# EAGLE design Transmitter (EAGLE 4.16)
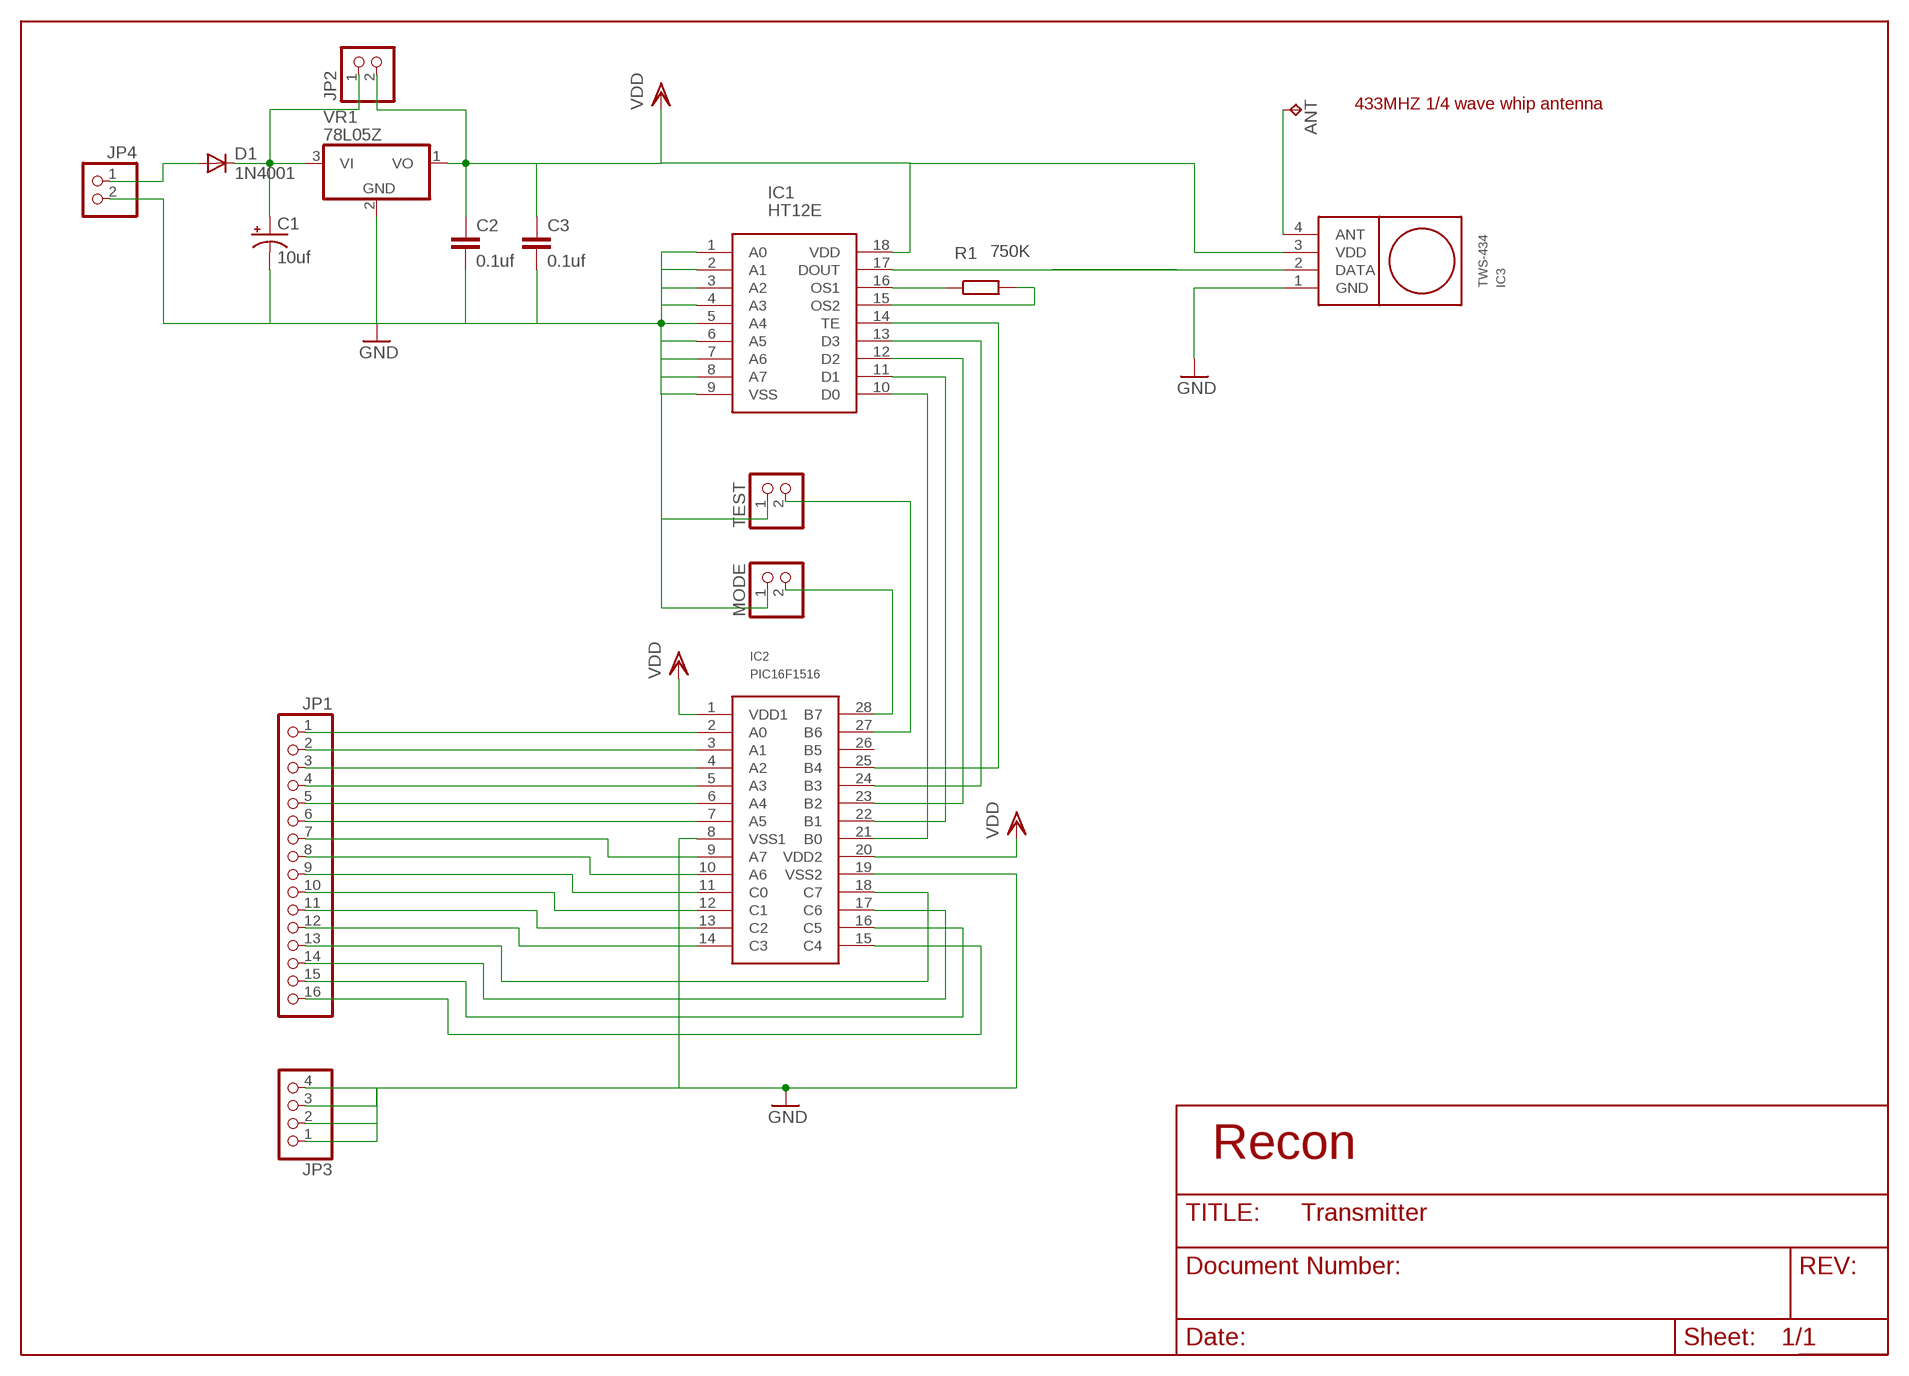
[diagram p0: schematic, sheet 1]

## Parts
ANT  433 qtr wave whip  TPPAD1-13Y  [P1-13Y]
C1  10uf  CPOL-USE2.5-5  [E2,5-5]
C2  0.1uf  C-EU050-024X044  [C050-024X044]
C3  0.1uf  C-EU050-024X044  [C050-024X044]
D1  1N4001  [DO41-10]
IC1  HT12E  [DIL18]
IC2  PIC16F1516  [DIL28-3]
IC3  TWS-434  [TWS-434]
JP1  PINHD-1X16  [1X16]
JP2  PINHD-1X2  [1X02]
JP3  PINHD-1X4  [1X04]
JP4  PINHD-1X2  [1X02]
MODE  PINHD-1X2  [1X02]
R1  750K  R-EU_0204/2V  [0204V]
TEST  PINHD-1X2  [1X02]
VR1  78L05Z  [TO92]

## Nets
D0: IC1.10(D0) IC2.21(B0)
D1: IC1.11(D1) IC2.22(B1)
D2: IC1.12(D2) IC2.23(B2)
D3: IC1.13(D3) IC2.24(B3)
D_OUT: IC1.17(DOUT) IC3.2(DATA)
GND: C1.- C2.2 C3.2 IC1.1(A0) IC1.2(A1) IC1.3(A2) IC1.4(A3) IC1.5(A4) IC1.6(A5) IC1.7(A6) IC1.8(A7) IC1.9(VSS) IC2.8(VSS1) IC2.19(VSS2) IC3.1(GND) JP3.1 JP3.2 JP3.3 JP3.4 JP4.2 MODE.1 TEST.1 VR1.2(GND)
MODE: IC2.28(B7) MODE.2
N$1: D1.A JP4.1
N$2: C1.+ D1.C JP2.1 VR1.3(VI)
N$3: IC1.16(OS1) R1.1
N$4: IC1.15(OS2) R1.2
N$6: ANT.1(TP) IC3.4(ANT)
N$8: IC2.2(A0) JP1.1
N$9: IC2.3(A1) JP1.2
N$10: IC2.4(A2) JP1.3
N$11: IC2.5(A3) JP1.4
N$12: IC2.6(A4) JP1.5
N$13: IC2.7(A5) JP1.6
N$14: IC2.9(A7) JP1.7
N$15: IC2.10(A6) JP1.8
N$16: IC2.11(C0) JP1.9
N$17: IC2.12(C1) JP1.10
N$18: IC2.13(C2) JP1.11
N$19: IC2.14(C3) JP1.12
N$20: IC2.18(C7) JP1.13
N$21: IC2.17(C6) JP1.14
N$22: IC2.16(C5) JP1.15
N$23: IC2.15(C4) JP1.16
TE: IC1.14(TE) IC2.25(B4)
TEST: IC2.27(B6) TEST.2
VDD: C2.1 C3.1 IC1.18(VDD) IC2.1(VDD1) IC2.20(VDD2) IC3.3(VDD) JP2.2 VR1.1(VO)
Unconnected: IC2.26(B5)

## Notes on the sheet
- 433MHZ 1/4 wave whip antenna

## Library data of the parts
ANT = Stofer:TP
C1 = rcl:CPOL-US: POLARIZED CAPACITOR, American symbol
C2 C3 = rcl:C-EU: CAPACITOR, European symbol
D1 = Recon:1N4001: DIODE general purpose rectifier, 1 A
IC1 = Recon:HT12E
IC2 = Recon:PIC16F1516
IC3 = Recon:TWS-434
JP1 = Headers:PINHD-1X16: PIN HEADER
JP2 JP4 MODE TEST = Headers:PINHD-1X2: PIN HEADER
JP3 = Headers:PINHD-1X4: PIN HEADER
R1 = rcl:R-EU_: RESISTOR, European symbol
VR1 = linear:78*: Positive VOLTAGE REGULATOR Source: http://cache.national.com/ds/LM/LM78L05.pdf http://www.fairchildsemi.com/ds/LM/LM7805.pdf

## Board
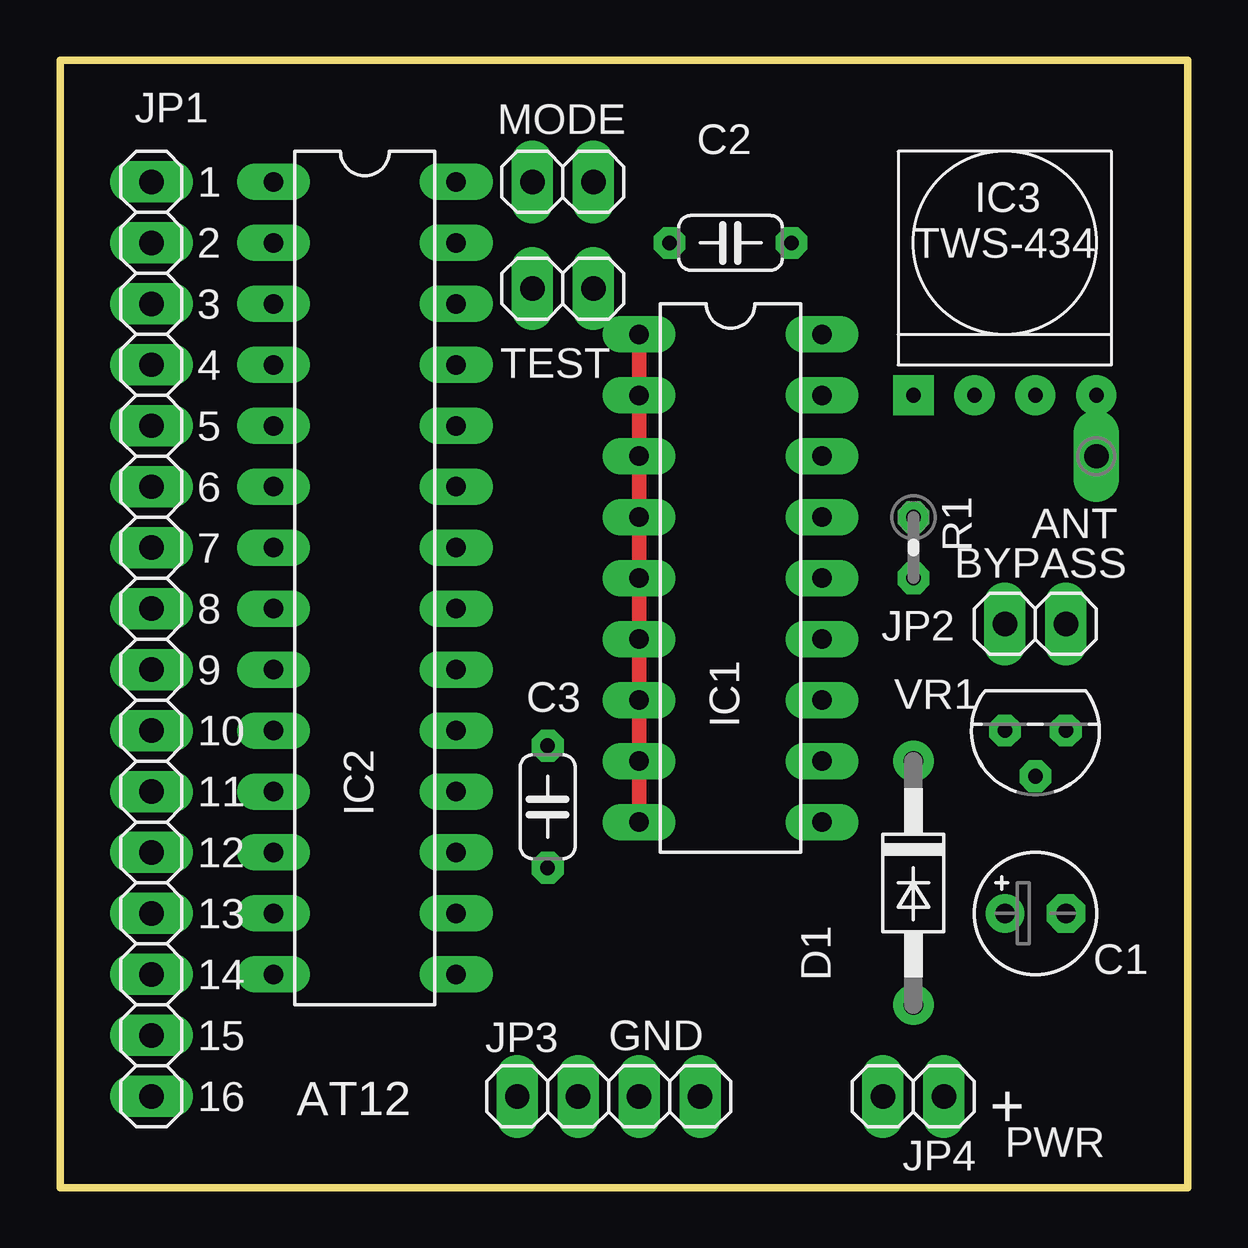
[diagram p1: board, top side]
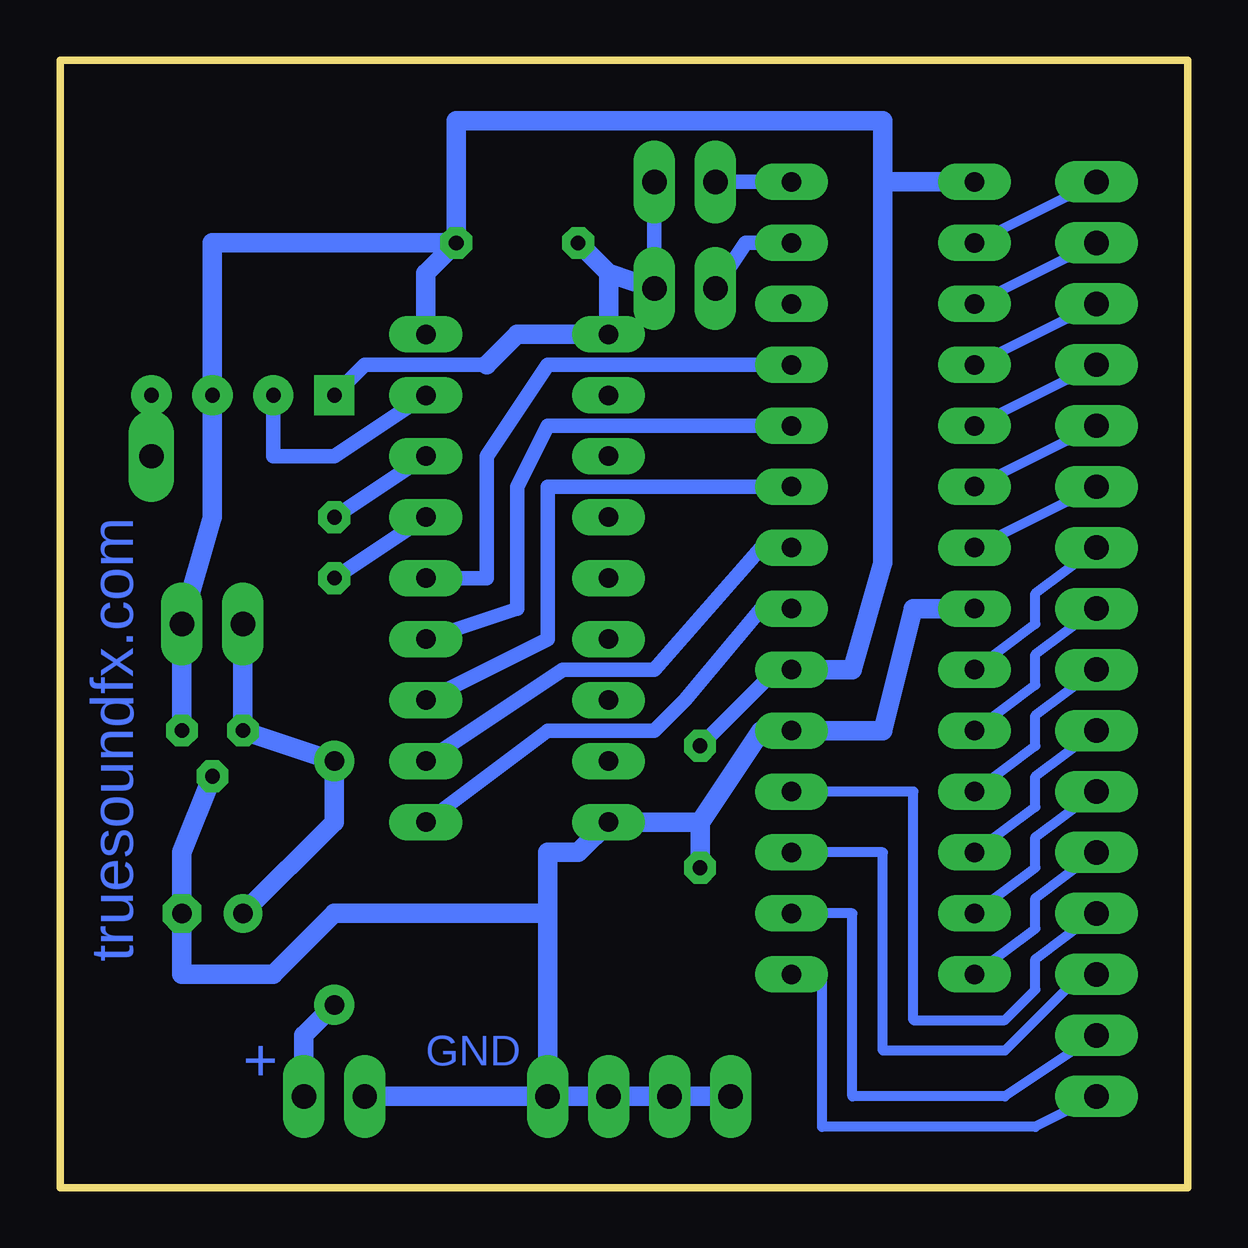
[diagram p2: board, bottom side, seen from below]

Size 46.99 x 46.99 mm. Coordinates in mm from the lower left corner, seen from the top.
Outline: 0,0 46.99,0 46.99,46.99 0,46.99 0,0
Copper layers (1*2+15*16): Top 0.035mm / dielectric 0.2mm / Route2 0.035mm / dielectric 0.15mm / Route15 0.035mm / dielectric 0.2mm / Bottom 0.035mm
Design rules "default": minimum track width 10mil, minimum drill 24mil, track to track 8mil, track to pad 8mil, pad to pad 8mil, via to via 8mil, smd to smd 8mil, copper to edge 40mil, drill to drill 8mil, minimum pad ring 14mil, minimum via ring 8mil, stop-mask expansion 4mil, vias tented up to drill 0mil, thermal gap 10mil

### Footprints (pad centres in the part's own frame; a part is rotated, then mirrored left to right if it is on the bottom)
P1-13Y = drill 1.016 pad 1.905 long: 1 0,0
E2,5-5 = drill 0.813 pad 1.6 round: + -1.27,0 | drill 0.813 pad 1.6 octagon: - 1.27,0
C050-024X044 = drill 0.61 octagon: 1 -2.54,0; 2 2.54,0
DO41-10 = drill 0.813 pad 1.676 round: A 5.08,0; C -5.08,0
DIL18 = drill 0.813 long: 1 -10.16,-3.81; 2 -7.62,-3.81; 3 -5.08,-3.81; 4 -2.54,-3.81; 5 0,-3.81; 6 2.54,-3.81; 7 5.08,-3.81; 8 7.62,-3.81; 9 10.16,-3.81; 10 10.16,3.81; 11 7.62,3.81; 12 5.08,3.81; 13 2.54,3.81; 14 0,3.81; 15 -2.54,3.81; 16 -5.08,3.81; 17 -7.62,3.81; 18 -10.16,3.81
DIL28-3 = drill 0.813 long: 1 -16.51,-3.81; 2 -13.97,-3.81; 3 -11.43,-3.81; 4 -8.89,-3.81; 5 -6.35,-3.81; 6 -3.81,-3.81; 7 -1.27,-3.81; 8 1.27,-3.81; 9 3.81,-3.81; 10 6.35,-3.81; 11 8.89,-3.81; 12 11.43,-3.81; 13 13.97,-3.81; 14 16.51,-3.81; 15 16.51,3.81; 16 13.97,3.81; 17 11.43,3.81; 18 8.89,3.81; 19 6.35,3.81; 20 3.81,3.81; 21 1.27,3.81; 22 -1.27,3.81; 23 -3.81,3.81; 24 -6.35,3.81; 25 -8.89,3.81; 26 -11.43,3.81; 27 -13.97,3.81; 28 -16.51,3.81
TWS-434 = drill 0.61 pad 1.676 square: 1 -5.08,-2.54 | drill 0.61 pad 1.676 round: 2 -2.54,-2.54; 3 0,-2.54; 4 2.54,-2.54
1X16 = drill 1.016 long: 1 -19.05,0; 2 -16.51,0; 3 -13.97,0; 4 -11.43,0; 5 -8.89,0; 6 -6.35,0; 7 -3.81,0; 8 -1.27,0; 9 1.27,0; 10 3.81,0; 11 6.35,0; 12 8.89,0; 13 11.43,0; 14 13.97,0; 15 16.51,0; 16 19.05,0
1X02 = drill 1.016 long: 1 -1.27,0; 2 1.27,0
1X04 = drill 1.016 long: 1 -3.81,0; 2 -1.27,0; 3 1.27,0; 4 3.81,0
0204V = drill 0.61 octagon: 1 -1.27,0; 2 1.27,0
TO92 = drill 0.61 octagon: 1 -1.27,0; 2 0,1.905; 3 1.27,0

### Placement (x,y rotation side)
ANT  43.18,30.48 180 top
C1  40.64,11.43 0 top
C2  27.94,39.37 180 top
C3  20.32,15.88 270 top
D1  35.56,12.7 270 top
IC1  27.94,25.4 270 top
IC2  12.7,25.4 270 top
IC3  40.64,35.56 0 top
JP1  3.81,22.86 270 top
JP2  40.64,23.5 0 top
JP3  22.86,3.81 0 top
JP4  35.56,3.81 180 top
MODE  20.95,41.91 180 top
R1  35.56,26.67 270 top
TEST  20.95,37.47 180 top
VR1  40.64,19.05 180 top

### Tracks (layer width: path | path; a pad name or v marks a point on that pad's centre or on a via)
D0
  Bottom 0.61: IC1.10 26.67,19.05 22.22,19.05 20.95,20.32 17.78,24.13 IC2.21
D1
  Bottom 0.61: IC1.11 26.04,21.59 22.22,21.59 17.78,26.67 IC2.22
D2
  Bottom 0.61: IC1.12 26.67,22.86 26.67,29.21 IC2.23
D3
  Bottom 0.61: IC1.13 27.94,24.13 27.94,29.21 26.67,31.75 IC2.24
D_OUT
  Bottom 0.61: IC1.17 35.56,30.48 38.1,30.48 IC3.2
GND
  Top 0.61: IC1.9 IC1.8 IC1.7 IC1.6 IC1.5 IC1.4 IC1.3 IC1.2 IC1.1
  Bottom 0.61: TEST.1 MODE.1 | 29.21,34.29 34.29,34.29 IC3.1
  Bottom 0.813: IC2.8 11.43,24.13 12.7,19.05 IC2.19 17.78,19.05 20.32,15.24 | 24.13,38.1 IC1.1 27.94,35.56 29.21,34.29 | 20.32,15.24 IC1.9 25.4,13.97 26.67,13.97 26.67,11.43 | 20.32,15.24 C3.2 | 24.13,38.1 C2.2 | 24.13,38.1 TEST.1 | JP3.1 JP3.2 JP3.3 JP3.4 | JP3.4 JP4.2 | JP3.4 26.67,11.43 | 26.67,11.43 35.56,11.43 38.1,8.89 41.91,8.89 C1.- 41.91,13.97 VR1.2
MODE
  Bottom 0.61: IC2.28 MODE.2
N$1
  Bottom 0.813: D1.A 36.83,6.35 JP4.1
N$2
  Bottom 0.813: JP2.1 VR1.3 D1.C 35.56,15.24 C1.+
N$3
  Bottom 0.61: R1.1 IC1.16
N$4
  Bottom 0.61: IC1.15 R1.2
N$6
  Bottom 0.813: ANT.1 IC3.4
N$8
  Bottom 0.406: IC2.2 JP1.1
N$9
  Bottom 0.406: IC2.3 JP1.2
N$10
  Bottom 0.406: IC2.4 JP1.3
N$11
  Bottom 0.406: IC2.5 JP1.4
N$12
  Bottom 0.406: IC2.6 JP1.5
N$13
  Bottom 0.406: IC2.7 JP1.6
N$14
  Bottom 0.406: IC2.9 6.35,23.5 6.35,24.77 JP1.7
N$15
  Bottom 0.406: IC2.10 6.35,20.95 6.35,22.23 JP1.8
N$16
  Bottom 0.406: IC2.11 6.35,18.41 6.35,19.68 JP1.9
N$17
  Bottom 0.406: IC2.12 6.35,15.88 6.35,17.14 JP1.10
N$18
  Bottom 0.406: IC2.13 6.35,13.34 6.35,14.61 JP1.11
N$19
  Bottom 0.406: IC2.14 6.35,10.79 6.35,12.06 JP1.12
N$20
  Bottom 0.406: IC2.18 11.43,16.51 11.43,6.99 7.62,6.99 6.35,8.26 6.35,9.53 JP1.13
N$21
  Bottom 0.406: IC2.17 12.7,13.97 12.7,5.71 7.62,5.71 4.45,8.89 JP1.14
N$22
  Bottom 0.406: IC2.16 13.97,11.43 13.97,3.81 7.62,3.81 JP1.15
N$23
  Bottom 0.406: IC2.15 15.24,8.89 15.24,2.54 6.35,2.54 JP1.16
TE
  Bottom 0.61: IC1.14 29.21,25.4 29.21,30.48 26.67,34.29 IC2.25
TEST
  Bottom 0.61: TEST.2 18.41,39.37 IC2.27
VDD
  Bottom 0.61: C3.1 17.14,21.59 IC2.20
  Bottom 0.813: 12.7,41.91 IC2.1 | 12.7,41.91 12.7,26.04 13.97,21.59 IC2.20 | IC1.18 31.75,38.1 C2.1 | 12.7,41.91 12.7,44.45 30.48,44.45 C2.1 | C2.1 40.64,39.37 IC3.3 40.64,27.94 JP2.2 VR1.1

### Text on the board
Bottom: truesoundfx.com | GND | +
tPlace: 1 | 2 | 3 | 4 | 5 | 6 | BYPASS | 7 | 8 | 9 | 10 | 11 | 12 | 13 | 14 | 15 | GND | AT12 | 16 | + | PWR
Drill_legend: Drill legend | Date: 9/17/2012 11:55:59a | 1.0160 mm / 40.000 mil | 0.8128 mm / 32.000 mil | 0.6096 mm / 24.000 mil